# Altium schematic sheet P05.FMC.SchDoc
size A4
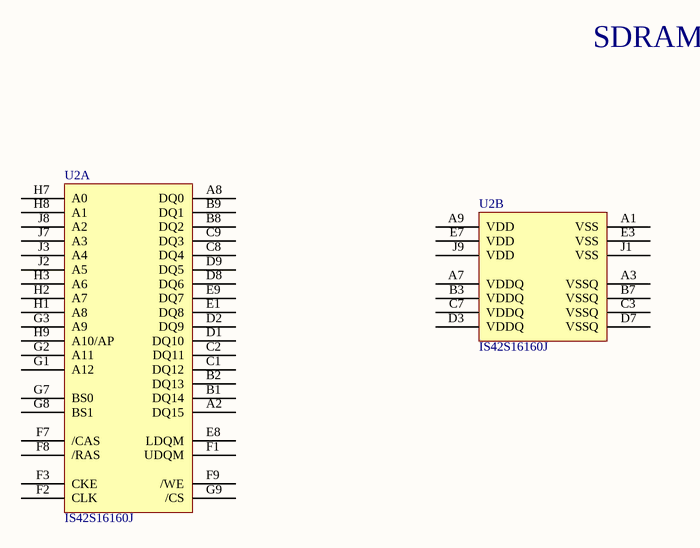
[diagram p0: P05.FMC.SchDoc]

## Parts
U2  IS42S16160J  [IS42S16160J-TFBGA54]  (parts A,B of 2)

## Nets

Not connected (* = marked no-connect by the designer): U2 A1(VSS) A2(DQ15) A3(VSSQ) A7(VDDQ) A8(DQ0) A9(VDD) B1(DQ14) B2(DQ13) B3(VDDQ) B7(VSSQ) B8(DQ2) B9(DQ1) C1(DQ12) C2(DQ11) C3(VSSQ) C7(VDDQ) C8(DQ4) C9(DQ3) D1(DQ10) D2(DQ9) D3(VDDQ) D7(VSSQ) D8(DQ6) D9(DQ5) E1(DQ8) E3(VSS) E7(VDD) E8(LDQM) E9(DQ7) F1(UDQM) F2(CLK) F3(CKE) F7(/CAS) F8(/RAS) F9(/WE) G1(A12) G2(A11) G3(A9) G7(BS0) G8(BS1) G9(/CS) H1(A8) H2(A7) H3(A6) H7(A0) H8(A1) H9(A10/AP) J1(VSS) J2(A5) J3(A4) J7(A3) J8(A2) J9(VDD)

## Notes on the sheet
- SDRAM

## Library data of the parts
U2 = IS42S16160J: 32Meg x 8, 16Meg x16, 256Mb SYNCHRONOUS DRAM